# Altium project steering_wheel_unit.PrjPcb (part 1 of 2)
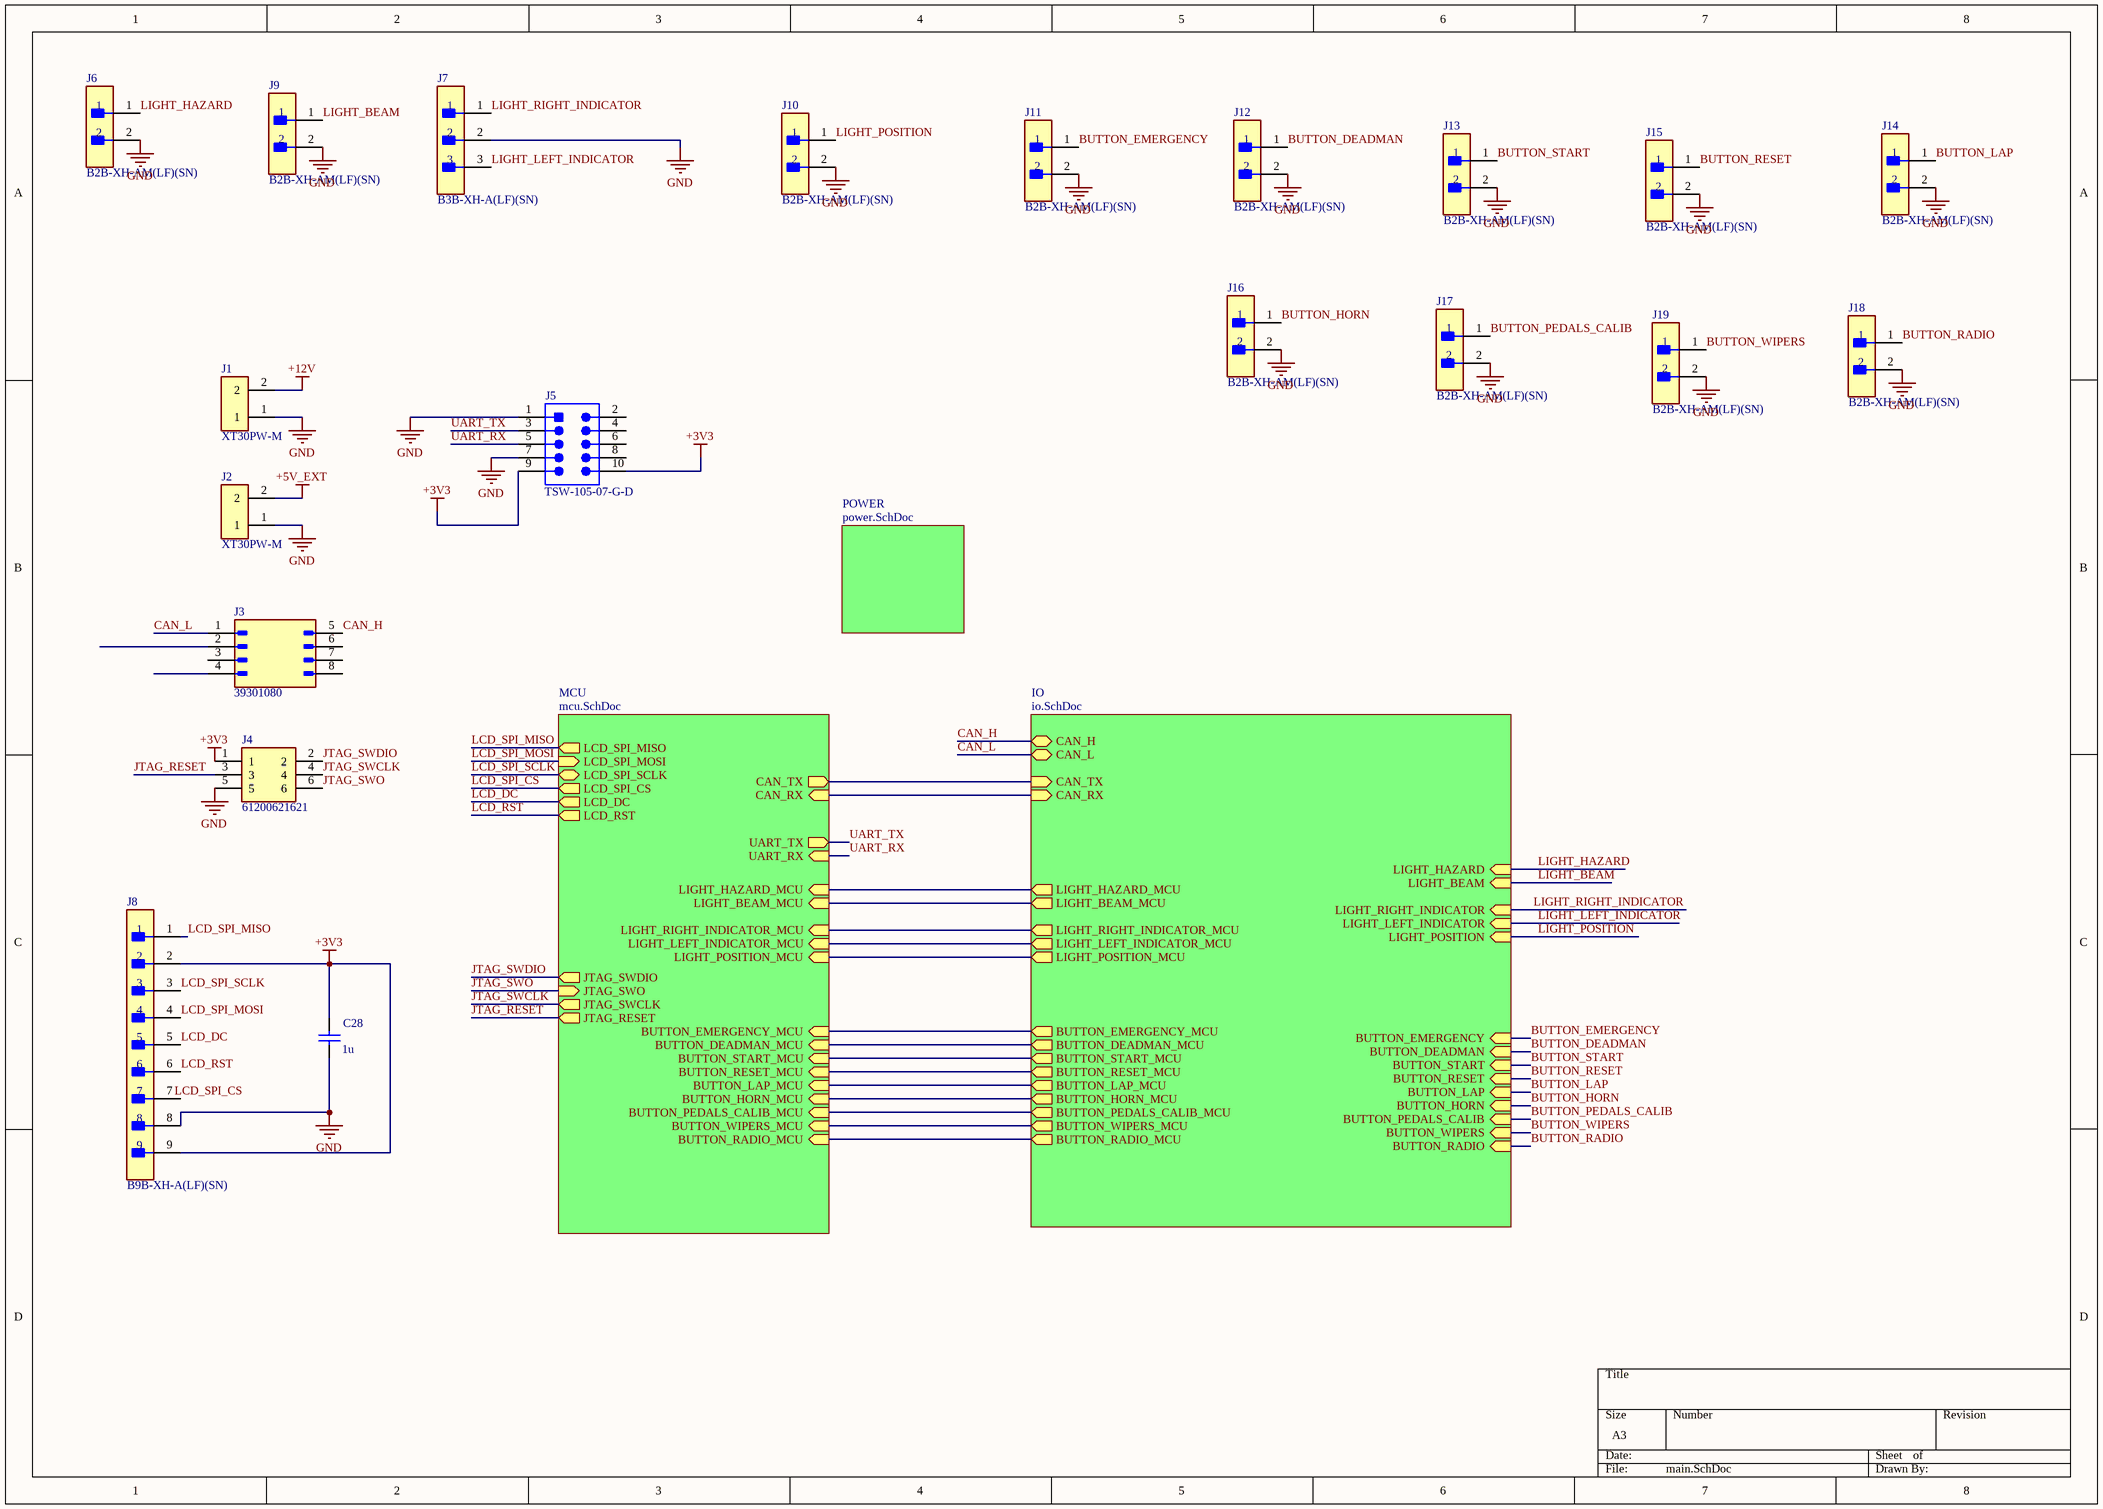
[diagram p0: main.SchDoc]
4 sheets, 109 parts. Net scope: hierarchical (ports join the sheet entries above them; power ports are global).
Board file: PCB1.PcbDoc
Sheets:
  main.SchDoc
    MCU = mcu.SchDoc
    IO = io.SchDoc
    POWER = power.SchDoc

## Sheet main.SchDoc
size A3; SheetNumber: 1; SheetTotal: 4

### Parts
C28  1u  [CAPC1206(3216)150_L]
J1  XT30PW-M  [XT30PWM]
J2  XT30PW-M  [XT30PWM]
J3  39301080  [39301080]
J4  61200621621  [61200621621]
J5  TSW-105-07-G-D  [SMTC-TSW-105-07-G-D_V]
J6  B2B-XH-AM(LF)(SN)  [FP-B2B-XH-AM_LF_SN-MFG]
J7  B3B-XH-A(LF)(SN)  [FP-B3B-XH-A_LF_SN-MFG]
J8  B9B-XH-A(LF)(SN)  [FP-B9B-XH-A_LF_SN-MFG]
J9  B2B-XH-AM(LF)(SN)  [FP-B2B-XH-AM_LF_SN-MFG]
J10  B2B-XH-AM(LF)(SN)  [FP-B2B-XH-AM_LF_SN-MFG]
J11  B2B-XH-AM(LF)(SN)  [FP-B2B-XH-AM_LF_SN-MFG]
J12  B2B-XH-AM(LF)(SN)  [FP-B2B-XH-AM_LF_SN-MFG]
J13  B2B-XH-AM(LF)(SN)  [FP-B2B-XH-AM_LF_SN-MFG]
J14  B2B-XH-AM(LF)(SN)  [FP-B2B-XH-AM_LF_SN-MFG]
J15  B2B-XH-AM(LF)(SN)  [FP-B2B-XH-AM_LF_SN-MFG]
J16  B2B-XH-AM(LF)(SN)  [FP-B2B-XH-AM_LF_SN-MFG]
J17  B2B-XH-AM(LF)(SN)  [FP-B2B-XH-AM_LF_SN-MFG]
J18  B2B-XH-AM(LF)(SN)  [FP-B2B-XH-AM_LF_SN-MFG]
J19  B2B-XH-AM(LF)(SN)  [FP-B2B-XH-AM_LF_SN-MFG]

### Sub-sheets
IO = io.SchDoc: CAN_TX (in), CAN_RX (in), CAN_H (bidir), CAN_L (bidir), LIGHT_HAZARD_MCU (out), LIGHT_BEAM_MCU (out), LIGHT_RIGHT_INDICATOR_MCU (out), LIGHT_LEFT_INDICATOR_MCU (out), LIGHT_POSITION_MCU (out), LIGHT_HAZARD (in), LIGHT_BEAM (in), LIGHT_RIGHT_INDICATOR (in), LIGHT_LEFT_INDICATOR (in), LIGHT_POSITION (in), BUTTON_EMERGENCY_MCU (out), BUTTON_DEADMAN_MCU (out), BUTTON_START_MCU (out), BUTTON_RESET_MCU (out), BUTTON_LAP_MCU (out), BUTTON_HORN_MCU (out), BUTTON_PEDALS_CALIB_MCU (out), BUTTON_WIPERS_MCU (out), BUTTON_RADIO_MCU (out), BUTTON_EMERGENCY (in), BUTTON_DEADMAN (in), BUTTON_START (in), BUTTON_RESET (in), BUTTON_LAP (in), BUTTON_HORN (in), BUTTON_PEDALS_CALIB (in), BUTTON_WIPERS (in), BUTTON_RADIO (in)
MCU = mcu.SchDoc: CAN_TX (out), CAN_RX (in), UART_TX (out), UART_RX (in), JTAG_SWDIO (out), JTAG_SWO (in), JTAG_SWCLK (out), JTAG_RESET (out), LCD_SPI_MISO (out), LCD_SPI_MOSI (in), LCD_SPI_SCLK (bidir), LCD_SPI_CS (out), LCD_DC (out), LCD_RST (out), LIGHT_HAZARD_MCU (in), LIGHT_BEAM_MCU (in), LIGHT_RIGHT_INDICATOR_MCU (in), LIGHT_LEFT_INDICATOR_MCU (in), LIGHT_POSITION_MCU (in), BUTTON_EMERGENCY_MCU (in), BUTTON_DEADMAN_MCU (in), BUTTON_START_MCU (in), BUTTON_RESET_MCU (in), BUTTON_LAP_MCU (in), BUTTON_HORN_MCU (in), BUTTON_PEDALS_CALIB_MCU (in), BUTTON_WIPERS_MCU (in), BUTTON_RADIO_MCU (in)
POWER = power.SchDoc: no entries

### Nets
+3V3: C28.1 J4.1 J5.9 J5.10 J8.2 J8.9
+5V_EXT: J2.2
+12V: J1.2
GND: C28.2 J1.1 J2.1 J4.5 J5.1 J5.7 J6.2 J7.2 J8.8 J9.2 J10.2 J11.2 J12.2 J13.2 J14.2 J15.2 J16.2 J17.2 J18.2 J19.2
BUTTON_DEADMAN: J12.1 ; sheet IO/BUTTON_DEADMAN
BUTTON_EMERGENCY: J11.1 ; sheet IO/BUTTON_EMERGENCY
BUTTON_HORN: J16.1 ; sheet IO/BUTTON_HORN
BUTTON_LAP: J14.1 ; sheet IO/BUTTON_LAP
BUTTON_PEDALS_CALIB: J17.1 ; sheet IO/BUTTON_PEDALS_CALIB
BUTTON_RADIO: J18.1 ; sheet IO/BUTTON_RADIO
BUTTON_RESET: J15.1 ; sheet IO/BUTTON_RESET
BUTTON_START: J13.1 ; sheet IO/BUTTON_START
BUTTON_WIPERS: J19.1 ; sheet IO/BUTTON_WIPERS
CAN_H: J3.5 ; sheet IO/CAN_H
CAN_L: J3.1 ; sheet IO/CAN_L
CAN_RX: sheet MCU/CAN_RX, sheet IO/CAN_RX
CAN_TX: sheet MCU/CAN_TX, sheet IO/CAN_TX
JTAG_RESET: J4.3 ; sheet MCU/JTAG_RESET
JTAG_SWCLK: J4.4 ; sheet MCU/JTAG_SWCLK
JTAG_SWDIO: J4.2 ; sheet MCU/JTAG_SWDIO
JTAG_SWO: J4.6 ; sheet MCU/JTAG_SWO
LCD_DC: J8.5 ; sheet MCU/LCD_DC
LCD_RST: J8.6 ; sheet MCU/LCD_RST
LCD_SPI_MISO: J8.1 ; sheet MCU/LCD_SPI_MISO
LCD_SPI_MOSI: J8.4 ; sheet MCU/LCD_SPI_MOSI
LCD_SPI_SCLK: J8.3 ; sheet MCU/LCD_SPI_SCLK
LIGHT_BEAM: J9.1 ; sheet IO/LIGHT_BEAM
LIGHT_HAZARD: J6.1 ; sheet IO/LIGHT_HAZARD
LIGHT_LEFT_INDICATOR: J7.3 ; sheet IO/LIGHT_LEFT_INDICATOR
LIGHT_POSITION: J10.1 ; sheet IO/LIGHT_POSITION
LIGHT_RIGHT_INDICATOR: J7.1 ; sheet IO/LIGHT_RIGHT_INDICATOR
UART_RX: J5.5 ; sheet MCU/UART_RX
UART_TX: J5.3 ; sheet MCU/UART_TX
NetB1_8: sheet MCU/LIGHT_HAZARD_MCU, sheet IO/LIGHT_HAZARD_MCU
NetB1_9: sheet MCU/LIGHT_BEAM_MCU, sheet IO/LIGHT_BEAM_MCU
NetB1_10: sheet MCU/LIGHT_POSITION_MCU, sheet IO/LIGHT_POSITION_MCU
NetB1_11: sheet MCU/LIGHT_RIGHT_INDICATOR_MCU, sheet IO/LIGHT_RIGHT_INDICATOR_MCU
NetB1_12: sheet MCU/LIGHT_LEFT_INDICATOR_MCU, sheet IO/LIGHT_LEFT_INDICATOR_MCU
NetB1_28: sheet MCU/BUTTON_PEDALS_CALIB_MCU, sheet IO/BUTTON_PEDALS_CALIB_MCU
NetB1_29: sheet MCU/BUTTON_HORN_MCU, sheet IO/BUTTON_HORN_MCU
NetB1_30: sheet MCU/BUTTON_LAP_MCU, sheet IO/BUTTON_LAP_MCU
NetB1_31: sheet MCU/BUTTON_RESET_MCU, sheet IO/BUTTON_RESET_MCU
NetB1_32: sheet MCU/BUTTON_START_MCU, sheet IO/BUTTON_START_MCU
NetB1_33: sheet MCU/BUTTON_DEADMAN_MCU, sheet IO/BUTTON_DEADMAN_MCU
NetB1_34: sheet MCU/BUTTON_EMERGENCY_MCU, sheet IO/BUTTON_EMERGENCY_MCU
NetB1_41: sheet MCU/BUTTON_RADIO_MCU, sheet IO/BUTTON_RADIO_MCU
NetB1_42: sheet MCU/BUTTON_WIPERS_MCU, sheet IO/BUTTON_WIPERS_MCU

Not connected (* = marked no-connect by the designer): J3 2 3 4 6 7 8; J5 2 4 6 8; J8 7

### Notes on the sheet
- Labels drawn without touching a wire or pin: LCD_SPI_CS

### Library data of the parts
C28 = CMP-1037-04778-1: CAP 1.8uF 10V ±5% 1206 (3216 Metric) Thickness 1.45mm SMD; Case-EIA: 1206; Tolerance: Â±5%; Case-Metric: 3216; Technology: SMT; Value: 1.8uF; Rated Voltage: 10 V; Max Thickness: 1.45 mm
J1 J2 = XT30PW-M: Plug; XT30; Male; 30A; Low Temperature Rise Fire Retardant; Manufacturer_Name: Amass; Geometry.Height: 5mm; Manufacturer_Part_Number: XT30PW-M; Mouser Part Number: *; Mouser Price/Stock: *; Arrow Part Number: *; Arrow Price/Stock: *; Datasheet Link: https://www.tme.eu/sl/Document/ce4077e36b79046da520ca73227e15de/XT30PW%20SPEC.pdf; ComponentLink1URL: https://datasheet.octopart.com/XT30PW-M-Amass-datasheet-165556440.pdf?src-supplier=TME; ComponentLink1Description: https://datasheet.octopart.com/XT30PW-M-Amass-datasheet-165556440.pdf?src-supplier=TME
J3 = 39301080: Connector Wire to Board Header 8 Position 4.2mm Solder Right Angle Thru-Hole Tray; Manufacturer Lifecycle Status: ACTIVE; MF: Molex; Approvals: CSA, TUV, UL; Connector Type: Power, Rectangular; Contact Resistance: 10mΩ; Current Rating: 8A; Gender: Male; Glow Wire Compliant: Non-compliant; Insulation Resistance: 1GΩ; Max Current Rating: 5A; Max Voltage Rating (DC): 250V; Number of Circuits: 6; Number of Contacts: 8; Plating Thickness: 2.54µm; Voltage Rating: 600V; SnapEDA_Link: https://www.snapeda.com/parts/39-30-1080/Molex/view-part/?ref=snap; Package: None; Value: *; MP: 39-30-1080; Check_prices: https://www.snapeda.com/parts/39-30-1080/Molex/view-part/?ref=eda; Supplier: RS; Supplier Part Number: 5109865P; Manufacturer: Molex; Manufacturer Part Number: 39-30-1080; RoHS: Compliant; Category: Headers and Wire Housings; Stock: 1025; China RoHS: Compliant; Color: Natural; Contact Gender: Male; Contact Material: Brass; Contact Plating: Tin; Country of Origin: US; Depth: 5.57mm; ELV: Compliant; Flammability Rating: UL94 V-2; Halogen Free: Low Halogen; Height: 9.9mm; Housing Material: Nylon; Lead Free: Lead Free; Lead Pitch: 4.2mm; Length: 15.65mm; Lifecycle Status: Production; Material: Nylon; Max Operating Temperature: 105°C; Min Operating Temperature: -40°C; Mounting Technology: PCB, Through Hole; Pins: 8; Number of Poles: 8; Number of Positions: 8; Number of Rows: 2; Orientation: Right Angle; Packaging: Bulk; Pitch: 4.2mm; Radiation Hardening: No; REACH SVHC: Yes; Row Spacing: 4.2mm; Schedule B: 8536694040, 8536694040|8536694040|8536694040|8536694040|8536694040; Termination: Solder; Voltage Rating (AC): 600V; Voltage Rating (DC): 600V; Working Voltage: 600V; ComponentLink1URL: https://datasheet.octopart.com:443/39-30-1080-Molex-datasheet-120074128.pdf?src-supplier=IHS; ComponentLink1Description: https://datasheet.octopart.com:443/39-30-1080-Molex-datasheet-120074128.pdf?src-supplier=IHS; ComponentLink2URL: https://datasheet.octopart.com:443/39-30-1080-Molex-datasheet-13785313.pdf?src-supplier=Sager+Electronics; ComponentLink2Description: https://datasheet.octopart.com:443/39-30-1080-Molex-datasheet-13785313.pdf?src-supplier=Sager+Electronics; ComponentLink3URL: https://sigma.octopart.com:443/15644801/technical_drawing/Molex-39-30-1080.pdf?src-supplier=Molex; ComponentLink3Description: https://sigma.octopart.com:443/15644801/technical_drawing/Molex-39-30-1080.pdf?src-supplier=Molex; ComponentLink4URL: https://datasheet.octopart.com:443/39-30-1080-Molex-datasheet-12555477.pdf?src-supplier=Molex; ComponentLink4Description: https://datasheet.octopart.com:443/39-30-1080-Molex-datasheet-12555477.pdf?src-supplier=Molex; ComponentLink5URL: https://datasheet.octopart.com:443/039301080-Molex-datasheet-8338717.pdf?src-supplier=Future+Electronics; ComponentLink5Description: https://datasheet.octopart.com:443/039301080-Molex-datasheet-8338717.pdf?src-supplier=Future+Electronics; ComponentLink6URL: https://datasheet.octopart.com:443/39301080-Molex-datasheet-137316104.pdf?src-supplier=Future+Electronics; ComponentLink6Description: https://datasheet.octopart.com:443/39301080-Molex-datasheet-137316104.pdf?src-supplier=Future+Electronics; ComponentLink7URL: https://datasheet.octopart.com:443/39-30-1080-Molex-datasheet-154749340.pdf?src-supplier=Master+Electronics; ComponentLink7Description: https://datasheet.octopart.com:443/39-30-1080-Molex-datasheet-154749340.pdf?src-supplier=Master+Electronics; ComponentLink8URL: https://datasheet.octopart.com:443/39-30-1080-Molex-datasheet-101582412.pdf?src-supplier=Farnell; ComponentLink8Description: https://datasheet.octopart.com:443/39-30-1080-Molex-datasheet-101582412.pdf?src-supplier=Farnell; ComponentLink9URL: https://datasheet.octopart.com:443/39-30-1080-Molex-datasheet-15687899.pdf?src-supplier=Farnell; ComponentLink9Description: https://datasheet.octopart.com:443/39-30-1080-Molex-datasheet-15687899.pdf?src-supplier=Farnell; ComponentLink10URL: https://datasheet.octopart.com:443/39-30-1080-Molex-datasheet-13550729.pdf?src-supplier=Farnell; ComponentLink10Description: https://datasheet.octopart.com:443/39-30-1080-Molex-datasheet-13550729.pdf?src-supplier=Farnell; ComponentLink11URL: https://datasheet.octopart.com:443/39-30-1080-Molex-datasheet-34223370.pdf?src-supplier=Electro+Sonic; ComponentLink11Description: https://datasheet.octopart.com:443/39-30-1080-Molex-datasheet-34223370.pdf?src-supplier=Electro+Sonic; ComponentLink12URL: https://datasheet.octopart.com:443/39-30-1080-Molex-datasheet-62104202.pdf?src-supplier=Electro+Sonic; ComponentLink12Description: https://datasheet.octopart.com:443/39-30-1080-Molex-datasheet-62104202.pdf?src-supplier=Electro+Sonic; ComponentLink13URL: https://datasheet.octopart.com:443/39-30-1080-Molex-datasheet-23709674.pdf?src-supplier=Electro+Sonic; ComponentLink13Description: https://datasheet.octopart.com:443/39-30-1080-Molex-datasheet-23709674.pdf?src-supplier=Electro+Sonic; ComponentLink14URL: https://datasheet.octopart.com:443/39-30-1080-Molex-datasheet-140183179.pdf?src-supplier=RS+(Formerly+Allied+Electronics); ComponentLink14Description: https://datasheet.octopart.com:443/39-30-1080-Molex-datasheet-140183179.pdf?src-supplier=RS+(Formerly+Allied+Electronics); ComponentLink15URL: https://datasheet.octopart.com:443/39-30-1080-Molex-datasheet-120148733.pdf?src-supplier=RS+(Formerly+Allied+Electronics); ComponentLink15Description: https://datasheet.octopart.com:443/39-30-1080-Molex-datasheet-120148733.pdf?src-supplier=RS+(Formerly+Allied+Electronics); ComponentLink16URL: https://datasheet.octopart.com:443/39-30-1080-Molex-datasheet-34442213.pdf?src-supplier=RS+(Formerly+Allied+Electronics); ComponentLink16Description: https://datasheet.octopart.com:443/39-30-1080-Molex-datasheet-34442213.pdf?src-supplier=RS+(Formerly+Allied+Electronics); ComponentLink17URL: https://datasheet.octopart.com:443/39-30-1080-Molex-datasheet-9783732.pdf?src-supplier=RS+(Formerly+Allied+Electronics); ComponentLink17Description: https://datasheet.octopart.com:443/39-30-1080-Molex-datasheet-9783732.pdf?src-supplier=RS+(Formerly+Allied+Electronics); ComponentLink18URL: https://datasheet.octopart.com:443/39-30-1080-Molex-datasheet-72655.pdf?src-supplier=RS+(Formerly+Allied+Electronics); ComponentLink18Description: https://datasheet.octopart.com:443/39-30-1080-Molex-datasheet-72655.pdf?src-supplier=RS+(Formerly+Allied+Electronics); ComponentLink19URL: https://datasheet.octopart.com:443/39-30-1080-Molex-datasheet-156091078.pdf?src-supplier=Jameco; ComponentLink19Description: https://datasheet.octopart.com:443/39-30-1080-Molex-datasheet-156091078.pdf?src-supplier=Jameco; ComponentLink20URL: https://datasheet.octopart.com:443/39301080-Molex-datasheet-8197183.pdf?src-supplier=Jameco; ComponentLink20Description: https://datasheet.octopart.com:443/39301080-Molex-datasheet-8197183.pdf?src-supplier=Jameco; ComponentLink21URL: https://datasheet.octopart.com:443/39-30-1080-Molex-datasheet-7269772.pdf?src-supplier=Jameco; ComponentLink21Description: https://datasheet.octopart.com:443/39-30-1080-Molex-datasheet-7269772.pdf?src-supplier=Jameco; ComponentLink22URL: https://datasheet.octopart.com:443/39-30-1080-Molex-datasheet-33002877.pdf?src-supplier=Newark; ComponentLink22Description: https://datasheet.octopart.com:443/39-30-1080-Molex-datasheet-33002877.pdf?src-supplier=Newark; ComponentLink23URL: https://datasheet.octopart.com:443/39-30-1080-Molex-datasheet-21207490.pdf?src-supplier=Newark; ComponentLink23Description: https://datasheet.octopart.com:443/39-30-1080-Molex-datasheet-21207490.pdf?src-supplier=Newark; ComponentLink24URL: https://datasheet.octopart.com:443/39-30-1080-Molex-datasheet-2405.pdf?src-supplier=Newark; ComponentLink24Description: https://datasheet.octopart.com:443/39-30-1080-Molex-datasheet-2405.pdf?src-supplier=Newark; ComponentLink25URL: https://datasheet.octopart.com:443/39-30-1080-Molex-datasheet-21395541.pdf?src-supplier=TME; ComponentLink25Description: https://datasheet.octopart.com:443/39-30-1080-Molex-datasheet-21395541.pdf?src-supplier=TME; ComponentLink26URL: https://datasheet.octopart.com:443/39-30-1080-Molex-datasheet-8361750.pdf?src-supplier=Verical; ComponentLink26Description: https://datasheet.octopart.com:443/39-30-1080-Molex-datasheet-8361750.pdf?src-supplier=Verical; ComponentLink27URL: https://datasheet.octopart.com:443/39-30-1080-Molex-datasheet-145504.pdf?src-supplier=DigiKey; ComponentLink27Description: https://datasheet.octopart.com:443/39-30-1080-Molex-datasheet-145504.pdf?src-supplier=DigiKey; ComponentLink28URL: http://sigma.octopart.com:80/15645381/rohs_certificate/Molex-39-30-1080.pdf?src-supplier=Compliance+Statements; ComponentLink28Description: http://sigma.octopart.com:80/15645381/rohs_certificate/Molex-39-30-1080.pdf?src-supplier=Compliance+Statements; ComponentLink29URL: http://sigma.octopart.com:80/conflict_mineral_statement/Molex-company-72.pdf?src-supplier=Compliance+Statements; ComponentLink29Description: http://sigma.octopart.com:80/conflict_mineral_statement/Molex-company-72.pdf?src-supplier=Compliance+Statements; ComponentLink30URL: http://sigma.octopart.com:80/rohs_statement/Molex-company-73.pdf?src-supplier=Compliance+Statements; ComponentLink30Description: http://sigma.octopart.com:80/rohs_statement/Molex-company-73.pdf?src-supplier=Compliance+Statements; ComponentLink31URL: http://sigma.octopart.com:80/reach_statement/Molex-company-74.pdf?src-supplier=Compliance+Statements; ComponentLink31Description: http://sigma.octopart.com:80/reach_statement/Molex-company-74.pdf?src-supplier=Compliance+Statements
J4 = 61200621621: Conn Shrouded Header (4 Sides) M 6 POS 2.54mm Solder ST Top Entry Thru-Hole Tray; Manufacturer_Name: Wurth Elektronik; Geometry.Height: 9.1mm; Connector Type: Male Pin; Contact Resistance: 20mΩ; Current Rating: 3A; Gender: Male; Insulation Resistance: 1GΩ; Number of Contacts: 6; Operating Supply Voltage: 250V; Manufacturer_Part_Number: 61200621621; Mouser Part Number: 710-61200621621; Mouser Price/Stock: https://www.mouser.co.uk/ProductDetail/Wurth-Elektronik/61200621621?qs=PhR8RmCirEbjX8n1RKw4Jw%3D%3D; Arrow Part Number: *; Arrow Price/Stock: *; Datasheet Link: https://katalog.we-online.de/em/datasheet/6120xx21621.pdf; Supplier: RS; Supplier Part Number: 8236430; Manufacturer: Wurth Elektronik; Manufacturer Part Number: 61200621621; RoHS: Compliant; Category: Headers and Wire Housings; Stock: 450; Color: Black; Contact Material: Copper; Contact Plating: Gold; Insulation Material: PBT; Lead Pitch: 2.54mm; Length: 15.28mm; Max Operating Temperature: 105°C; Min Operating Temperature: -40°C; Mounting Technology: Through Hole; Pins: 6; Number of Positions: 6; Number of Rows: 2; Orientation: Vertical; Pitch: 2.54mm; Row Spacing: 2.54mm; Termination: Solder; ComponentLink1URL: https://datasheet.octopart.com:443/61200621621-Wurth-Elektronik-datasheet-168479915.pdf?src-supplier=Newark; ComponentLink1Description: https://datasheet.octopart.com:443/61200621621-Wurth-Elektronik-datasheet-168479915.pdf?src-supplier=Newark; ComponentLink2URL: https://datasheet.octopart.com:443/61200621621-W%C3%BCrth-Elektronik-datasheet-5367532.pdf?src-supplier=Newark; ComponentLink2Description: https://datasheet.octopart.com:443/61200621621-W%C3%BCrth-Elektronik-datasheet-5367532.pdf?src-supplier=Newark; ComponentLink3URL: https://datasheet.octopart.com:443/61200621621-W%C3%BCrth-Elektronik-datasheet-62127819.pdf?src-supplier=Upverter; ComponentLink3Description: https://datasheet.octopart.com:443/61200621621-W%C3%BCrth-Elektronik-datasheet-62127819.pdf?src-supplier=Upverter; ComponentLink4URL: https://datasheet.octopart.com:443/61200621621-W%C3%BCrth-Elektronik-datasheet-111087935.pdf?src-supplier=Wurth+Elektronik; ComponentLink4Description: https://datasheet.octopart.com:443/61200621621-W%C3%BCrth-Elektronik-datasheet-111087935.pdf?src-supplier=Wurth+Elektronik; ComponentLink5URL: https://datasheet.octopart.com:443/61200621621-W%C3%BCrth-Elektronik-datasheet-149523874.pdf?src-supplier=Farnell; ComponentLink5Description: https://datasheet.octopart.com:443/61200621621-W%C3%BCrth-Elektronik-datasheet-149523874.pdf?src-supplier=Farnell
J5 = CMP-2000-07330-1: Post Terminal Strip Assembly, Pitch 2.54 mm, 2 x 5 Position, Height 8.58 mm, Tail Length 2.54 mm, -55 to 125 degC, RoHS, Bulk; Manufacturer: Samtec-Inc.; Connector Type: Header,Unshrouded; Number of Positions Loaded: All; Pitch: 0.100"(2.54mm); Number of Positions: 10; Package Reference: TSW-105-07-G-D; Mounting Technology: ThroughHole; Datasheet URL: http://suddendocs.samtec.com/prints/tsw-xxx-xx-xxx-x-xx-xxx-mkt.pdf; Termination: Solder; Packaging: Bulk; Number of Rows: 2; Contact Finish: Gold; Mounting Type: ThroughHole; Features: -; Color: Black; Category: Connectors,Interconnects; Family: RectangularConnectors-Headers,MalePins; Manufacturer URL: http://www.samtec.com/; Series: TSW; Fastening Type: -; Package URL: http://suddendocs.samtec.com/prints/tsw-xxx-xx-x-x-xx-xxx-footprint.pdf; Row Spacing: 0.100"(2.54mm); Contact Mating Length: 0.230"(5.84mm); Contact Finish Thickness: 10µin(0.25µm); Contact Type: MalePin; Package Description: Male Header, Pitch 2.54 mm, 2 x 5 Position, Height 8.58 mm, Tail Length 2.54 mm; Datasheet Version: Rev. DO, 08/1988
J6 J9-J19 = CMP-17439-000037-1: CONN HEADER VERT 2POS 2.5MM; Max Voltage Rating (AC): 250V; Connector Type: Male Pin; Contact Resistance: 20mR; Max Current Rating: 3A; Number of Positions: 2; Series: XH; Contact Material: Brass; Mount: Through Hole; Housing Material: Polyamide; Contact Plating: Tin; Termination: Solder; Max Operating Temperature: 85°C; Depth: 5.75mm; Packaging: Bulk; Min Operating Temperature: -25°C; Contact Type: Male Pin; Color: Green; Pitch: 2.5mm; Length: 7.4mm; Lead Free: Lead Free; Number of Rows: 1; Fastening Type: Detent; Housing Color: White; Orientation: Straight
J7 = CMP-17439-000014-3: CONN HEADER VERT 3POS 2.5MM; Max Voltage Rating (DC): 250V; Number of Positions: 3; Current Rating: 3A; Gender: Male; Wire/Cable Gauge: 22AWG; Contact Resistance: 20mR; Insulation Resistance: 1GR; Insulation Material: Nylon; Contact Plating: Tin; Depth: 5.75mm; Contact Type: Male Pin; Max Operating Temperature: 85°C; Insulation Color: Natural; Voltage Rating (AC): 250V; Color: Natural; Connector Type: Header; Orientation: Straight; Fastening Type: Detent; Housing Color: White; Min Operating Temperature: -25°C; Termination: Solder; Voltage Rating: 250V; Series: XH; Pitch: 2.5mm; Contact Shape: Square; Number of Rows: 1; Lead Free: Lead Free; Packaging: Bulk; Mount: Through Hole; Flammability Rating: UL94 V-0; Max Voltage Rating (AC): 250V; REACH SVHC: No SVHC; Housing Material: Polyamide; Contact Material: Brass; Lead Pitch: 2.5mm; Contact Finish - Mating: TIN; Length: 9.9mm; Max Current Rating: 3A; Number of Contacts: 3
J8 = CMP-17439-000168-1: CONN HEADER VERT 9POS 2.5MM; Wire/Cable Gauge: 22AWG; Current Rating: 3A; Insulation Resistance: 1GR; Mated Stacking Heights: 9.8mm; Max Voltage Rating (AC): 250V; Contact Resistance: 20mR; Gender: Male; Number of Contacts: 9; Orientation: Straight; Contact Finish - Mating: TIN; Number of Rows: 1; Max Operating Temperature: 85°C; Contact Plating: Tin; Flammability Rating: UL94 V-0; Length: 24.9mm; REACH SVHC: No SVHC; Depth: 5.75mm; Housing Color: White; Package Quantity: 250; Lead Pitch: 2.5mm; Connector Type: Header; Voltage Rating (AC): 250V; Packaging: Bulk; Color: Natural; Min Operating Temperature: -25°C; Insulation Color: Natural; Insulation Material: Nylon; Voltage Rating: 250V; Pitch: 2.5mm; Lead Free: Lead Free; Contact Shape: Square; Housing Material: Polyamide; Series: XH; Termination: Solder; Contact Type: Male Pin; Mount: Through Hole; Max Current Rating: 3A; Number of Positions: 9; Contact Material: Brass; Fastening Type: Detent

## Sheet mcu.SchDoc
size A4; SheetNumber: 2; SheetTotal: 4
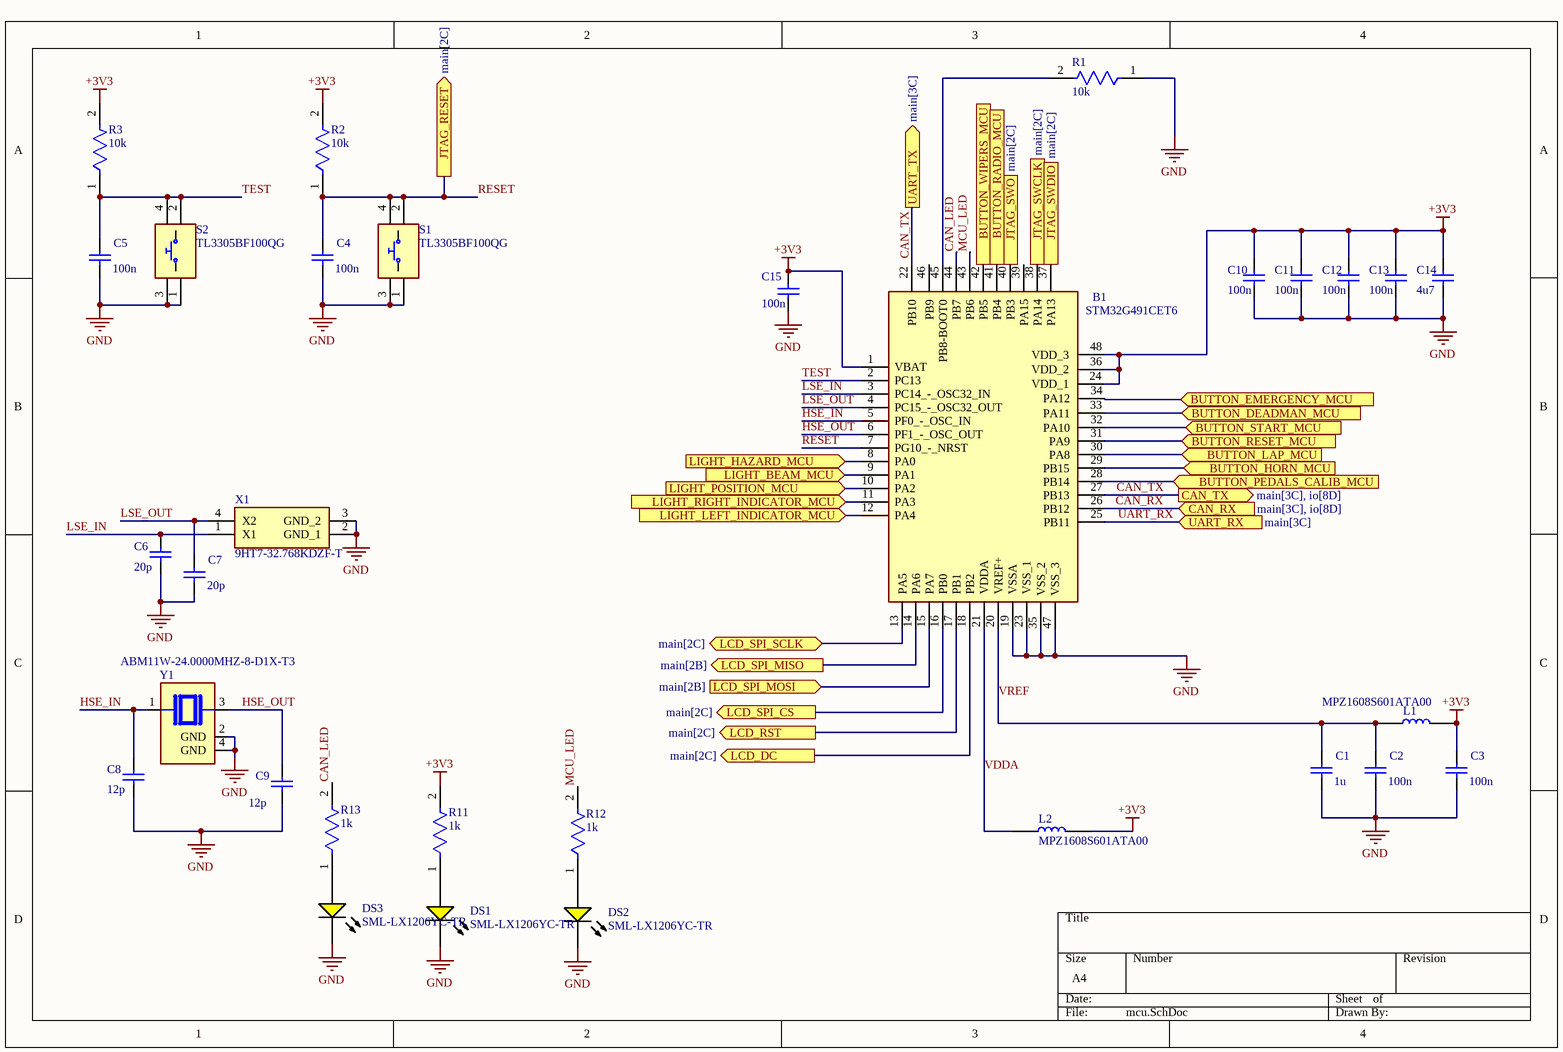
[diagram p1: mcu.SchDoc]

### Parts
B1  STM32G491CET6  [STM32G491CET6]
C1  1u  [CAPC1206(3216)150_L]
C2  100n  [CAPC1206(3216)150_L]
C3  100n  [CAPC1206(3216)150_L]
C4  100n  [CAPC1206(3216)150_L]
C5  100n  [CAPC1206(3216)150_L]
C6  20p  [CAPC1206(3216)150_L]
C7  20p  [CAPC1206(3216)150_L]
C8  12p  [CAPC1206(3216)150_L]
C9  12p  [CAPC1206(3216)150_L]
C10  100n  [CAPC1206(3216)150_L]
C11  100n  [CAPC1206(3216)150_L]
C12  100n  [CAPC1206(3216)150_L]
C13  100n  [CAPC1206(3216)150_L]
C14  4u7  [CAPC1206(3216)150_L]
C15  100n  [CAPC1206(3216)150_L]
DS1  SML-LX1206YC-TR  [LUMX-SML-LX1206YC-TR_V]
DS2  SML-LX1206YC-TR  [LUMX-SML-LX1206YC-TR_V]
DS3  SML-LX1206YC-TR  [LUMX-SML-LX1206YC-TR_V]
L1  MPZ1608S601ATA00  [INDC1608X95N]
L2  MPZ1608S601ATA00  [INDC1608X95N]
R1  10k  [FP-RK73H2B-MFG]
R2  10k  [FP-RK73H2B-MFG]
R3  10k  [FP-RK73H2B-MFG]
R11  1k  [FP-RK73H2B-MFG]
R12  1k  [FP-RK73H2B-MFG]
R13  1k  [FP-RK73H2B-MFG]
S1  TL3305BF100QG  [TL3305BF160QG]
S2  TL3305BF100QG  [TL3305BF160QG]
X1  9HT7-32.768KDZF-T  [9HT732768KDZFT]
Y1  ABM11W-24.0000MHZ-8-D1X-T3  [XTAL_ABM11W-24.0000MHZ-8-D1X-T3]

### Ports
BUTTON_DEADMAN_MCU (in), BUTTON_EMERGENCY_MCU (in), BUTTON_HORN_MCU (in), BUTTON_LAP_MCU (in), BUTTON_PEDALS_CALIB_MCU (in), BUTTON_RADIO_MCU (in), BUTTON_RESET_MCU (in), BUTTON_START_MCU (in), BUTTON_WIPERS_MCU (in), CAN_RX (in, see main[3C], io[8D]), CAN_TX (out, see main[3C], io[8D]), JTAG_RESET (out, see main[2C]), JTAG_SWCLK (out, see main[2C]), JTAG_SWDIO (out, see main[2C]), JTAG_SWO (in, see main[2C]), LCD_DC (out, see main[2C]), LCD_RST (out, see main[2C]), LCD_SPI_CS (out, see main[2C]), LCD_SPI_MISO (out, see main[2B]), LCD_SPI_MOSI (in, see main[2B]), LCD_SPI_SCLK (bidir, see main[2C]), LIGHT_BEAM_MCU (in), LIGHT_HAZARD_MCU (in), LIGHT_LEFT_INDICATOR_MCU (in), LIGHT_POSITION_MCU (in), LIGHT_RIGHT_INDICATOR_MCU (in), UART_RX (in, see main[3C]), UART_TX (out, see main[3C])

### Nets
+3V3: B1.1(VBAT) B1.24(VDD_1) B1.36(VDD_2) B1.48(VDD_3) C3.1 C10.1 C11.1 C12.1 C13.1 C14.1 C15.1 L1.2 L2.2 R2.2 R3.2 R11.2
GND: B1.19(VSSA) B1.23(VSS_1) B1.35(VSS_2) B1.47(VSS_3) C1.2 C2.2 C3.2 C4.2 C5.2 C6.2 C7.2 C8.2 C9.2 C10.2 C11.2 C12.2 C13.2 C14.2 C15.2 DS1.2(K) DS2.2(K) DS3.2(K) R1.1 S1.1 S1.3 S2.1 S2.3 X1.2(GND_1) X1.3(GND_2) Y1.2(GND) Y1.4(GND)
CAN_LED: B1.44(PB7) R13.2
CAN_RX: B1.26(PB12) ; port CAN_RX
CAN_TX: B1.27(PB13) ; port CAN_TX
HSE_IN: B1.5(PF0_-_OSC_IN) C8.1 Y1.1
HSE_OUT: B1.6(PF1_-_OSC_OUT) C9.1 Y1.3
JTAG_SWCLK: B1.38(PA14) ; port JTAG_SWCLK
JTAG_SWDIO: B1.37(PA13) ; port JTAG_SWDIO
JTAG_SWO: B1.40(PB3) ; port JTAG_SWO
LCD_DC: B1.18(PB2) ; port LCD_DC
LCD_RST: B1.17(PB1) ; port LCD_RST
LCD_SPI_CS: B1.16(PB0) ; port LCD_SPI_CS
LCD_SPI_MISO: B1.14(PA6) ; port LCD_SPI_MISO
LCD_SPI_MOSI: B1.15(PA7) ; port LCD_SPI_MOSI
LCD_SPI_SCLK: B1.13(PA5) ; port LCD_SPI_SCLK
LSE_IN: B1.3(PC14_-_OSC32_IN) C6.1 X1.1(X1)
LSE_OUT: B1.4(PC15_-_OSC32_OUT) C7.1 X1.4(X2)
MCU_LED: B1.43(PB6) R12.2
RESET: B1.7(PG10_-_NRST) C4.1 R2.1 S1.2 S1.4 ; port JTAG_RESET  [project net JTAG_RESET]
TEST: B1.2(PC13) C5.1 R3.1 S2.2 S2.4
UART_RX: B1.25(PB11) ; port UART_RX
UART_TX: B1.22(PB10) ; port UART_TX
VDDA: B1.21(VDDA) L2.1
VREF: B1.20(VREF+) C1.1 C2.1 L1.1
NetB1_8: B1.8(PA0) ; port LIGHT_HAZARD_MCU
NetB1_9: B1.9(PA1) ; port LIGHT_BEAM_MCU
NetB1_10: B1.10(PA2) ; port LIGHT_POSITION_MCU
NetB1_11: B1.11(PA3) ; port LIGHT_RIGHT_INDICATOR_MCU
NetB1_12: B1.12(PA4) ; port LIGHT_LEFT_INDICATOR_MCU
NetB1_28: B1.28(PB14) ; port BUTTON_PEDALS_CALIB_MCU
NetB1_29: B1.29(PB15) ; port BUTTON_HORN_MCU
NetB1_30: B1.30(PA8) ; port BUTTON_LAP_MCU
NetB1_31: B1.31(PA9) ; port BUTTON_RESET_MCU
NetB1_32: B1.32(PA10) ; port BUTTON_START_MCU
NetB1_33: B1.33(PA11) ; port BUTTON_DEADMAN_MCU
NetB1_34: B1.34(PA12) ; port BUTTON_EMERGENCY_MCU
NetB1_41: B1.41(PB4) ; port BUTTON_RADIO_MCU
NetB1_42: B1.42(PB5) ; port BUTTON_WIPERS_MCU
NetB1_45: B1.45(PB8-BOOT0) R1.2
NetDS1_1: DS1.1(A) R11.1
NetDS2_1: DS2.1(A) R12.1
NetDS3_1: DS3.1(A) R13.1

Not connected (* = marked no-connect by the designer): B1 39(PA15) 46(PB9)

### Notes on the sheet
- Labels drawn without touching a wire or pin: CAN_TX

### Library data of the parts
B1 = STM32G491CET6: ARM Microcontrollers - MCU Mainstream Arm Cortex-M4+ MCU 170MHz with 512Kbytes of Flash memory; Manufacturer_Name: STMicroelectronics; Geometry.Height: 1.6mm; Manufacturer_Part_Number: STM32G491CET6; Mouser Part Number: 511-STM32G491CET6; Mouser Price/Stock: https://www.mouser.co.uk/ProductDetail/STMicroelectronics/STM32G491CET6?qs=eP2BKZSCXI5LxAF%2FNuF5Tg%3D%3D; Arrow Part Number: STM32G491CET6; Arrow Price/Stock: https://www.arrow.com/en/products/stm32g491cet6/stmicroelectronics?region=nac; Datasheet Link: https://cz.mouser.com/datasheet/2/389/dm00654712-2042072.pdf; Supplier: Mouser; Supplier Part Number: 511-STM32G491CET6; Supplier 1: Mouser; Supplier Part Number 1: 511-STM32G491CET6; ComponentLink1Description: Datasheet; ComponentLink1URL: https://datasheet.octopart.com/STM32G491CET6-STMicroelectronics-datasheet-151949616.pdf?src-supplier=Future+Electronics
C1-C15 = CMP-1037-04778-1: as C28 on sheet main; Technology: SMT; Value: 1.8uF; Rated Voltage: 10 V; Max Thickness: 1.45 mm
DS1-DS3 = CMP-2000-07124-1: Yellow LED, Water Clear Len, 585 nm, 2.1 V, -40 to 85 degC, 2-Pin SMD, RoHS, Tape and Reel; Manufacturer: Lumex; Product Training Modules: LEDsBenefitsofCustomLEDandLCDTechnology; Millicandela Rating: 6mcd; Catalog Drawings: SML-LX1206SeriesTopSML-LX1206SeriesSideSML-LX1206SeriesBottomSML-LX1206SeriesFootprint; Wavelength - Peak: 585nm; Other Names: 67-1358-2LU60357TRSMLLX1206YCTR; Lens Style/Size: RectanglewithFlatTop; Current - Test: 20mA; Lens Color: Colorless; Viewing Angle: 160°; Voltage - Forward (Vf) (Typ): 2.1V; Online Catalog: SML-LX1206RectanglewithFlatTop1206PackageLEDs; Mounting Type: SurfaceMount; Package Description: 2-Pin Surface Mount Device, Body 3.2 x 1.5 mm; Datasheet Version: Rev. K, 08/2012; Features: -; Color: Yellow; RoHS Information: RoHSCertofCompliance; Package Reference: SML-LX1206YC-TR; Supplier Device Package: 1206; Standard Package: 3,000; Series: -; Wavelength - Dominant: -; Package / Case: 1206(3216Metric); Mounting Technology: SurfaceMount; Height (Max): 1.10mm; Lens Transparency: Clear; Datasheet URL: http://www.lumex.com/content/files/ProductAttachment/SML-LX1206YC-TR.pdf; Family: LEDIndication-Discrete; Manufacturer URL: http://www.lumexinstruments.com/; Packaging: Tape&Reel(TR); Category: Optoelectronics; Size / Dimension: 3.20mmLx1.60mmW
L1 L2 = MPZ1608S601ATA00: Ferrite Beads Multi-Layer 600Ohm 25% 100MHz 1A 0.15Ohm DCR 0603 T/R; Manufacturer Lifecycle Status: PRODUCTION; MF: TDK; DC Resistance (DCR): 150mΩ; Impedance: 600Ω; Number of Circuits: 1; SnapEDA_Link: https://www.snapeda.com/parts/MPZ1608S601ATA00/TDK/view-part/?ref=snap; Package: 0603 TDK; Value: *; MP: MPZ1608S601ATA00; Check_prices: https://www.snapeda.com/parts/MPZ1608S601ATA00/TDK/view-part/?ref=eda; Supplier: Farnell; Supplier Part Number: 2800777; Manufacturer: TDK; Manufacturer Part Number: MPZ1608S601ATA00; RoHS: Compliant; Category: Ferrite Beads and Chips; Stock: 80000; Case/Package: 0603; Case Code (Imperial): 0603; Case Code (Metric): 1608; China RoHS: Compliant; Core Material: Ferrite; Current Rating: 1A; Depth: 800µm; Height: 800µm; Lead Free: Lead Free; Length: 1.6mm; Lifecycle Status: Production; Max DC Current: 1A; Clock Frequency: 100MHz; Max Length: 1.75mm; Max Operating Temperature: 125°C; Max Width: 950µm; Min Length: 1.45mm; Min Operating Temperature: -55°C; Min Width: 650µm; Mounting Technology: Surface Mount; Number of Terminals: 2; Packaging: Cut Tape; REACH SVHC: Yes; RMS Current (Irms): 1A; Schedule B: 8504500000, 8504500000|8504500000|8504500000|8504500000|8504500000; ESR: 150mΩ; Termination: SMD/SMT; Test Frequency: 100MHz; Tolerance: 25%; Weight: 2.012816mg; Width: 800µm; ComponentLink1URL: https://datasheet.octopart.com:443/MPZ1608S601ATA00-TDK-datasheet-155380319.pdf?src-supplier=TDK; ComponentLink1Description: https://datasheet.octopart.com:443/MPZ1608S601ATA00-TDK-datasheet-155380319.pdf?src-supplier=TDK; ComponentLink2URL: https://datasheet.octopart.com:443/MPZ1608S601ATA00-TDK-datasheet-141913842.pdf?src-supplier=TME; ComponentLink2Description: https://datasheet.octopart.com:443/MPZ1608S601ATA00-TDK-datasheet-141913842.pdf?src-supplier=TME; ComponentLink3URL: https://datasheet.octopart.com:443/MPZ1608S601ATA00-TDK-datasheet-82475260.pdf?src-supplier=Newark; ComponentLink3Description: https://datasheet.octopart.com:443/MPZ1608S601ATA00-TDK-datasheet-82475260.pdf?src-supplier=Newark; ComponentLink4URL: https://datasheet.octopart.com:443/MPZ1608S601ATA00-TDK-datasheet-99917310.pdf?src-supplier=Newark; ComponentLink4Description: https://datasheet.octopart.com:443/MPZ1608S601ATA00-TDK-datasheet-99917310.pdf?src-supplier=Newark; ComponentLink5URL: https://datasheet.octopart.com:443/MPZ1608S601ATA00-TDK-datasheet-8852356.pdf?src-supplier=Newark; ComponentLink5Description: https://datasheet.octopart.com:443/MPZ1608S601ATA00-TDK-datasheet-8852356.pdf?src-supplier=Newark; ComponentLink6URL: https://datasheet.octopart.com:443/MPZ1608S601ATA00-TDK-datasheet-21631858.pdf?src-supplier=Farnell; ComponentLink6Description: https://datasheet.octopart.com:443/MPZ1608S601ATA00-TDK-datasheet-21631858.pdf?src-supplier=Farnell; ComponentLink7URL: https://datasheet.octopart.com:443/MPZ1608S601ATA00-TDK-datasheet-38423207.pdf?src-supplier=Future+Electronics; ComponentLink7Description: https://datasheet.octopart.com:443/MPZ1608S601ATA00-TDK-datasheet-38423207.pdf?src-supplier=Future+Electronics
R1-R3 R11-R13 = CMP-04015-098385-1: 40.2kΩ ±1% 0.25W Chip Resistor 1206 Thick Film AEC-Q200 Qualified; Resistance: 40.2kR; Voltage Rating (DC): 200V; Temperature Coefficient: 100ppm/°C; Power Rating: 250mW; Tolerance: 1%; Package Quantity: 5000; Length: 3.2mm; Termination: SMD/SMT; Lead Free: Contains Lead; Case Code (Imperial): 1206; Case/Package: 1206; Voltage Rating: 200V; Case Code (Metric): 3216; Max Operating Temperature: 155°C; Packaging: Tape and Reel; Width: 1.6mm; Series: RK73H; Min Operating Temperature: -55°C; RoHS Compliant: No; Height: 0.6mm
S1 S2 = TL3305BF100QG: TL3305 Ultra-Miniature Tact Switch 100gf 5.0mm actuator Silver Contact Gullwing; Manufacturer_Name: E-Switch; Datasheet Link: https://configured-product-images.s3.amazonaws.com/2D/specs/TL3305BF100QG.pdf; Manufacturer_Part_Number: TL3305BF100QG; Mouser Part Number: 612-TL3305BF100QG; Mouser Price/Stock: https://www.mouser.co.uk/ProductDetail/E-Switch/TL3305BF100QG?qs=IKkN%2F947nfDIPwqPQja%252BvQ%3D%3D; Supplier: Farnell; Supplier Part Number: 4539028; Manufacturer: E-Switch; Manufacturer Part Number: TL3305BF100QG; RoHS: Compliant; Category: Tactile Switches; Stock: 11760; ComponentLink1URL: https://datasheet.octopart.com:443/TL3305BF100QG-E-Switch-datasheet-181388209.pdf?src-supplier=Future+Electronics; ComponentLink1Description: https://datasheet.octopart.com:443/TL3305BF100QG-E-Switch-datasheet-181388209.pdf?src-supplier=Future+Electronics; ComponentLink2URL: https://datasheet.octopart.com:443/TL3305BF100QG-E-Switch-datasheet-188129426.pdf?src-supplier=Future+Electronics; ComponentLink2Description: https://datasheet.octopart.com:443/TL3305BF100QG-E-Switch-datasheet-188129426.pdf?src-supplier=Future+Electronics
X1 = 9HT7-32.768KDZF-T: Parallel - Fundamental Quartz Crystal, 0.032768MHz Nom; Manufacturer_Name: TXC CORPORATION; Manufacturer: TXC; Geometry.Height: 1.4mm; ESR (Equivalent Series Resistance): 65kΩ; Frequency: 32.768kHz; Frequency Tolerance: 0.002%; Load Capacitance: 12.5pF; Manufacturer_Part_Number: 9HT7-32.768KDZF-T; Mouser Part Number: 717-9HT7-32.768KDZFT; Mouser Price/Stock: https://www.mouser.co.uk/ProductDetail/TXC-Corporation/9HT7-32.768KDZF-T?qs=MEJ8UTjcHDlobjP3Uu4Bsg%3D%3D; Arrow Part Number: 9HT7-32.768KDZF-T; Arrow Price/Stock: https://www.arrow.com/en/products/9ht7-32.768kdzf-t/txc-corporation?region=nac; Datasheet Link: https://componentsearchengine.com/Datasheets/2/9HT7-32.768KDZF-T.pdf; Supplier: Farnell; Supplier Part Number: 2819319; Manufacturer Part Number: 9HT7-32.768KDZF-T; RoHS: Compliant; Category: Crystals; Stock: 7957; Case/Package: SMD/SMT; Height: 508µm; Lead Free: Lead Free; Length: 1.4mm; Lifecycle Status: Production; Max Operating Temperature: 85°C; Min Operating Temperature: -40°C; Mounting Technology: Surface Mount; Packaging: Tape & Reel; REACH SVHC: No; Schedule B: 8541600080, 8541600080|8541600080|8541600080|8541600080|8541600080|8541600080|8541600080|8541600080|8541600080|8541600080|8541600080|8541600080|8541600080|8541600080|8541600080|8541600080|8541600080|8541600080|8541600080|8541600080|8541600080|8541600080|8541600080|85; Termination: SMD/SMT; Tolerance: 0.002%; Width: 1.397mm; ComponentLink1URL: https://datasheet.octopart.com:443/9HT7-32.768KDZF-T-TXC-datasheet-21225340.pdf?src-supplier=element14+APAC; ComponentLink1Description: https://datasheet.octopart.com:443/9HT7-32.768KDZF-T-TXC-datasheet-21225340.pdf?src-supplier=element14+APAC; ComponentLink2URL: https://datasheet.octopart.com:443/9HT7-32.768KDZF-T-TXC-datasheet-181441158.pdf?src-supplier=Newark; ComponentLink2Description: https://datasheet.octopart.com:443/9HT7-32.768KDZF-T-TXC-datasheet-181441158.pdf?src-supplier=Newark; ComponentLink3URL: https://datasheet.octopart.com:443/9HT7-32.768KDZF-T-TXC-datasheet-188932442.pdf?src-supplier=TME; ComponentLink3Description: https://datasheet.octopart.com:443/9HT7-32.768KDZF-T-TXC-datasheet-188932442.pdf?src-supplier=TME
Y1 = ABM11W-24.0000MHZ-8-D1X-T3: Crystal, Quartz, 24 MHz, SMD, 2mm x 1.6mm x 0.5mm, 20 ppm, 8 pF, 10 ppm, ABM11W; Manufacturer: Abracon; MF: Abracon LLC; ESR (Equivalent Series Resistance): 100Ω; Frequency: 24MHz; Frequency Stability: 20ppm; Frequency Tolerance: 0.001%; Load Capacitance: 8pF; ESR: 30Ω; SnapEDA_Link: https://www.snapeda.com/parts/ABM11W-24.0000MHZ-8-D1X-T3/Abracon/view-part/?ref=snap; Package: SMD-4 Abracon LLC; Value: *; MP: ABM11W-24.0000MHZ-8-D1X-T3; Check_prices: https://www.snapeda.com/parts/ABM11W-24.0000MHZ-8-D1X-T3/Abracon/view-part/?ref=eda; Supplier: DigiKey; Supplier Part Number: 535-13835-1-ND; Manufacturer Part Number: ABM11W-24.0000MHZ-8-D1X-T3; RoHS: Compliant; Category: Crystals; Stock: 2752; Pricing: 1=0,38, 10=0,334, 25=0,3156, 50=0,3024, 100=0,29, 250=0,27424, 500=0,26288, 1000=0,25201 (USD); China RoHS: Compliant; Height: 500µm; Length: 2mm; Lifecycle Status: Production; Max Operating Temperature: 85°C; Min Operating Temperature: -40°C; Mounting Technology: Surface Mount; REACH SVHC: Yes; Tolerance: 0.001%; Width: 1.6mm; ComponentLink1URL: https://datasheet.octopart.com:443/ABM11W-24.0000MHZ-8-D1X-T3-Abracon-datasheet-154833168.pdf?src-supplier=IHS; ComponentLink1Description: https://datasheet.octopart.com:443/ABM11W-24.0000MHZ-8-D1X-T3-Abracon-datasheet-154833168.pdf?src-supplier=IHS; ComponentLink2URL: https://datasheet.octopart.com:443/ABM11W-24.0000MHZ-8-D1X-T3-Abracon-datasheet-102760955.pdf?src-supplier=Upverter; ComponentLink2Description: https://datasheet.octopart.com:443/ABM11W-24.0000MHZ-8-D1X-T3-Abracon-datasheet-102760955.pdf?src-supplier=Upverter; ComponentLink3URL: https://datasheet.octopart.com:443/ABM11W-24.0000MHZ-8-D1X-T3-Abracon-datasheet-112015802.pdf?src-supplier=Master+Electronics; ComponentLink3Description: https://datasheet.octopart.com:443/ABM11W-24.0000MHZ-8-D1X-T3-Abracon-datasheet-112015802.pdf?src-supplier=Master+Electronics; ComponentLink4URL: https://datasheet.octopart.com:443/ABM11W-24.0000MHZ-8-D1X-T3-Abracon-datasheet-182204996.pdf?src-supplier=Master+Electronics; ComponentLink4Description: https://datasheet.octopart.com:443/ABM11W-24.0000MHZ-8-D1X-T3-Abracon-datasheet-182204996.pdf?src-supplier=Master+Electronics; ComponentLink5URL: https://sigma.octopart.com:443/141159858/technical_drawing/Abracon-ABM11W-24.0000MHZ-8-D1X-T3.pdf?src-supplier=Abracon+SCT; ComponentLink5Description: https://sigma.octopart.com:443/141159858/technical_drawing/Abracon-ABM11W-24.0000MHZ-8-D1X-T3.pdf?src-supplier=Abracon+SCT; ComponentLink6URL: http://sigma.octopart.com:80/conflict_mineral_statement/Abracon-company-27.pdf?src-supplier=Compliance+Statements; ComponentLink6Description: http://sigma.octopart.com:80/conflict_mineral_statement/Abracon-company-27.pdf?src-supplier=Compliance+Statements